# EAGLE design MODUL_PORTEXP_V101 (EAGLE 6.4)
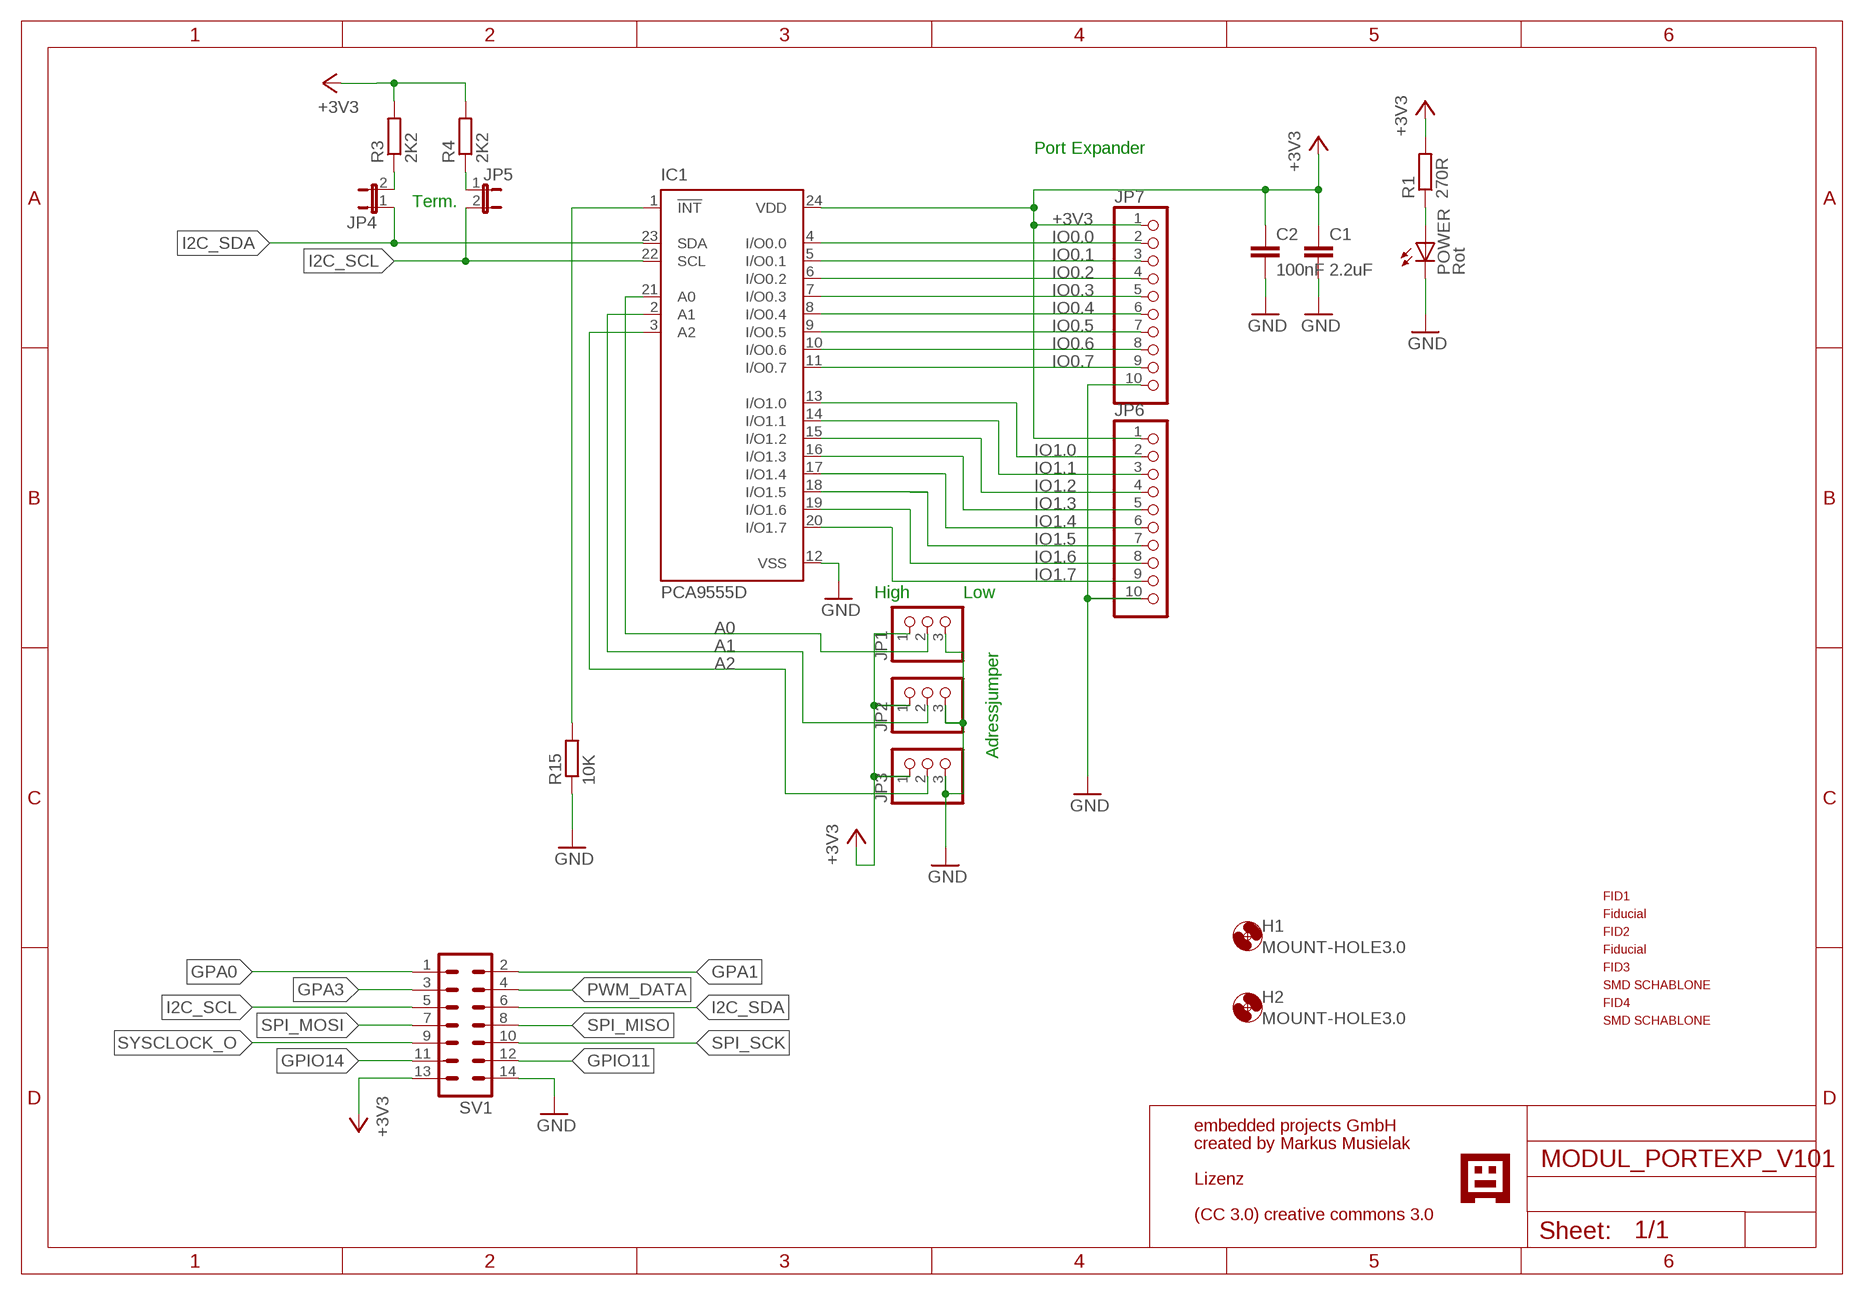
[diagram p0: schematic, sheet 1]

## Parts
C1  2.2uF  C-EUC0805  [C0805]
C2  100nF  C-EUC0805  [C0805]
FID1  PASSERMARKEN_FIDUCIAL  [PASSERMARKEN_FIDUCIAL]
FID2  PASSERMARKEN_FIDUCIAL  [PASSERMARKEN_FIDUCIAL]
FID3  PASSERMARKEN_FIDUCIAL  [PASSERMARKEN_FIDUCIAL]
FID4  PASSERMARKEN_FIDUCIAL  [PASSERMARKEN_FIDUCIAL]
H1  MOUNT-HOLE3.0  [3,0]
H2  MOUNT-HOLE3.0  [3,0]
IC1  PCA9555D  [SO24]
JP1  PINHD-1X3  [1X03]
JP2  PINHD-1X3  [1X03]
JP3  PINHD-1X3  [1X03]
JP4  JP1E  [JP1]
JP5  JP1E  [JP1]
JP6  PINHD-1X10  [1X10]
JP7  PINHD-1X10  [1X10]
POWER  Rot  LEDCHIP-LED0805  [CHIP-LED0805]
R1  270R  R-EU_R0805  [R0805]
R3  2K2  R-EU_R0805  [R0805]
R4  2K2  R-EU_R0805  [R0805]
R15  10K  R-EU_R0805  [R0805]
SV1  ML14  [ML14]
U$2  GNUBLINLOGOSIEB  [GNUSIEBDRUCK]

## Nets
!INT: IC1.1(!INT) R15.2
+3V3: C1.1 C2.1 IC1.24(VDD) JP1.1 JP2.1 JP3.1 JP6.1 JP7.1 R1.2 R3.2 R4.2 SV1.13
A0: IC1.21(A0) JP1.2
A1: IC1.2(A1) JP2.2
A2: IC1.3(A2) JP3.2
GND: C1.2 C2.2 IC1.12(VSS) JP1.3 JP2.3 JP3.3 JP6.10 JP7.10 POWER.C R15.1 SV1.14
GPA0: SV1.1
GPA1: SV1.2
GPA3: SV1.3
GPIO11: SV1.12
GPIO14: SV1.11
I2C_SCL: IC1.22(SCL) JP5.2 SV1.5
I2C_SDA: IC1.23(SDA) JP4.1 SV1.6
IO0.0: IC1.4(I/O0.0) JP7.2
IO0.1: IC1.5(I/O0.1) JP7.3
IO0.2: IC1.6(I/O0.2) JP7.4
IO0.3: IC1.7(I/O0.3) JP7.5
IO0.4: IC1.8(I/O0.4) JP7.6
IO0.5: IC1.9(I/O0.5) JP7.7
IO0.6: IC1.10(I/O0.6) JP7.8
IO0.7: IC1.11(I/O0.7) JP7.9
IO1.0: IC1.13(I/O1.0) JP6.2
IO1.1: IC1.14(I/O1.1) JP6.3
IO1.2: IC1.15(I/O1.2) JP6.4
IO1.3: IC1.16(I/O1.3) JP6.5
IO1.4: IC1.17(I/O1.4) JP6.6
IO1.5: IC1.18(I/O1.5) JP6.7
IO1.6: IC1.19(I/O1.6) JP6.8
IO1.7: IC1.20(I/O1.7) JP6.9
N$1: JP4.2 R3.1
N$2: POWER.A R1.1
N$5: JP5.1 R4.1
PWM_DATA: SV1.4
SPI_MISO: SV1.8
SPI_MOSI: SV1.7
SPI_SCK: SV1.10
SYSCLOCK_O: SV1.9

## Notes on the sheet
- Port Expander
- Term.
- High | Low
- Adressjumper
- embedded projects GmbH
- created by Markus Musielak
- Lizenz
- (CC 3.0) creative commons 3.0

## Library data of the parts
C1 C2 = rcl:C-EU: CAPACITOR, European symbol
FID1 FID2 = KUBUS3:PASSERMARKEN_FIDUCIAL: SMD Passermarke
FID3 FID4 = SMDSCHABLONE:PASSERMARKEN_FIDUCIAL: SMD Passermarke
H1 H2 = holes:MOUNT-HOLE: MOUNTING HOLE with drill center marker
IC1 = micro-philips:PCA9555: 16-bit I2C and SMBus I/O port with interrupt Source: PCA9555_5.pdf; MPN: PCA9555DW; OC_FARNELL: 8906076; OC_NEWARK: 63K6067
JP1-JP3 = pinhead:PINHD-1X3: PIN HEADER
JP4 JP5 = jumper:JP1E: JUMPER
JP6 JP7 = pinhead:PINHD-1X10: PIN HEADER
POWER = led:LED: LED OSRAM: - CHIPLED LG R971, LG N971, LY N971, LG Q971, LY Q971, LO R971, LY R971 LH N974, LH R974 LS Q976, LO Q976, LY Q976 LO Q996 - Hyper CHIPLED LW Q18S LB Q993, LB Q99A, LB R99A - SideLED LS A670, LO A670, LY A670, LG A670, LP A670 LB A673, LV A673, LT A673, LW A673 LH A674 LY A675 LS A676, LA A676, LO A676, LY A676, LW A676 LS A679, LY A679, LG A679 - Hyper Micro SIDELED® LS Y876, LA Y876, LO Y876, LY Y876 LT Y87S - SmartLED LW L88C, LW L88S LB L89C, LB L89S, LG L890 LS L89K, LO L89K, LY L89K LS L896, LA L896, LO L896, LY L896 - TOPLED LS T670, LO T670, LY T670, LG T670, LP T670 LSG T670, LSP T670, LSY T670, LOP T670, LYG T670 LG T671, LOG T671, LSG T671 LB T673, LV T673, LT T673, LW T673 LH T674 LS T676, LA T676, LO T676, LY T676, LB T676, LH T676, LSB T676, LW T676 LB T67C, LV T67C, LT T67C, LS T67K, LO T67K, LY T67K, LW E67C LS E67B, LA E67B, LO E67B, LY E67B, LB E67C, LV E67C, LT E67C LW T67C LS T679, LY T679, LG T679 LS T770, LO T770, LY T770, LG T770, LP T770 LB T773, LV T773, LT T773, LW T773 LH T774 LS E675, LA E675, LY E675, LS T675 LS T776, LA T776, LO T776, LY T776, LB T776 LHGB T686 LT T68C, LB T68C - Hyper Mini TOPLED® LB M676 - Mini TOPLED Santana® LG M470 LS M47K, LO M47K, LY M47K Source: http://www.osram.convergy.de LUXEON: - LUMILED® LXK2-PW12-R00, LXK2-PW12-S00, LXK2-PW14-U00, LXK2-PW14-V00 LXK2-PM12-R00, LXK2-PM12-S00, LXK2-PM14-U00 LXK2-PE12-Q00, LXK2-PE12-R00, LXK2-PE12-S00, LXK2-PE14-T00, LXK2-PE14-U00 LXK2-PB12-K00, LXK2-PB12-L00, LXK2-PB12-M00, LXK2-PB14-N00, LXK2-PB14-P00, LXK2-PB14-Q00 LXK2-PR12-L00, LXK2-PR12-M00, LXK2-PR14-Q00, LXK2-PR14-R00 LXK2-PD12-Q00, LXK2-PD12-R00, LXK2-PD12-S00 LXK2-PH12-R00, LXK2-PH12-S00 LXK2-PL12-P00, LXK2-PL12-Q00, LXK2-PL12-R00 Source: www.luxeon.com KINGBRIGHT: KA-3528ASYC Source: www.kingbright.com
R1 R3 R4 R15 = rcl:R-EU_: RESISTOR, European symbol
SV1 = con-ml:ML14: HARTING; OC_FARNELL: unknown; OC_NEWARK: unknown
U$2 = EmbeddedProjectsLogos2:GNUBLINLOGO

## Board
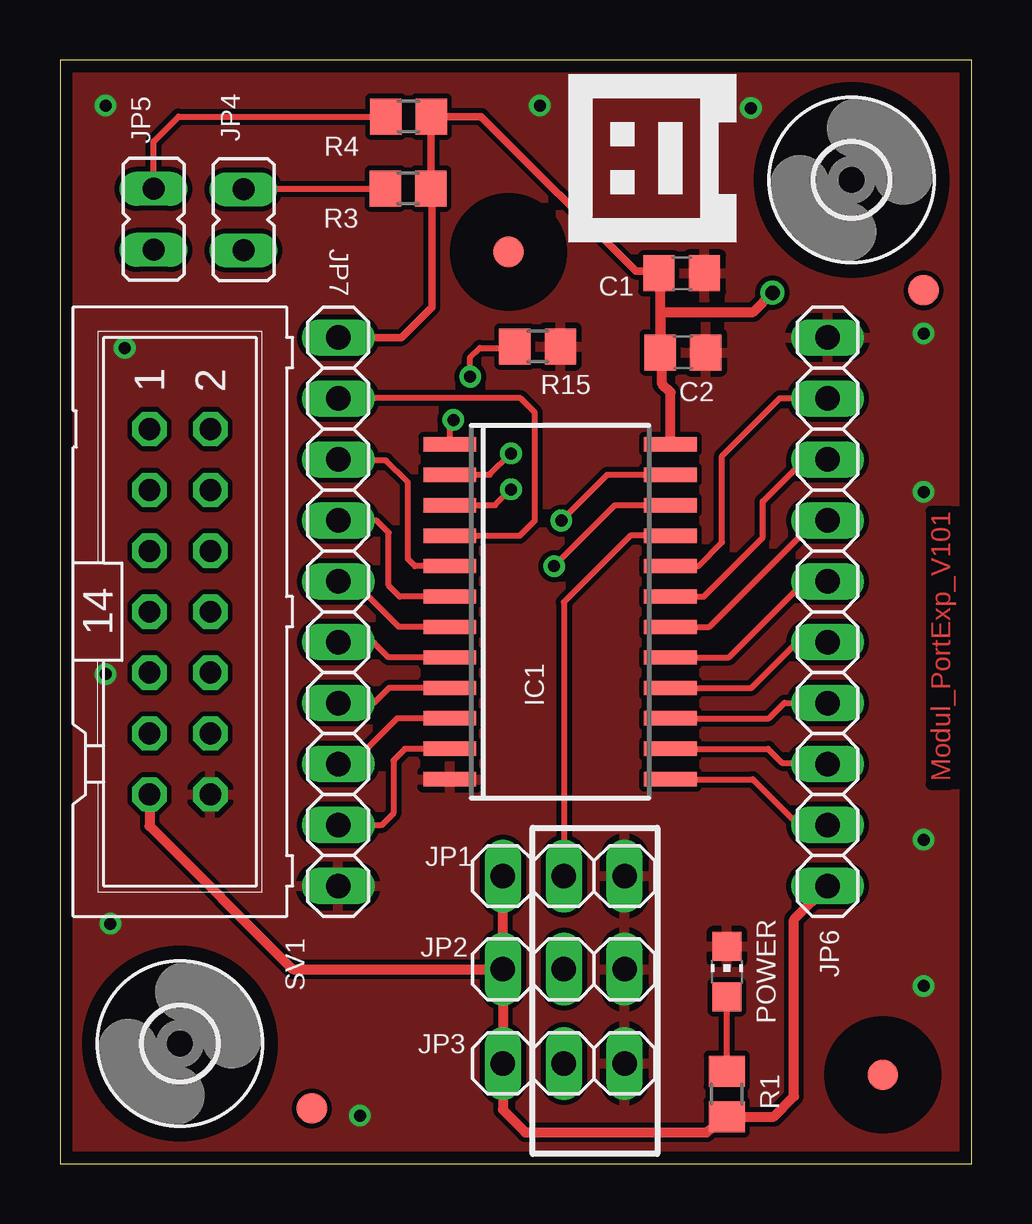
[diagram p1: board, top side]
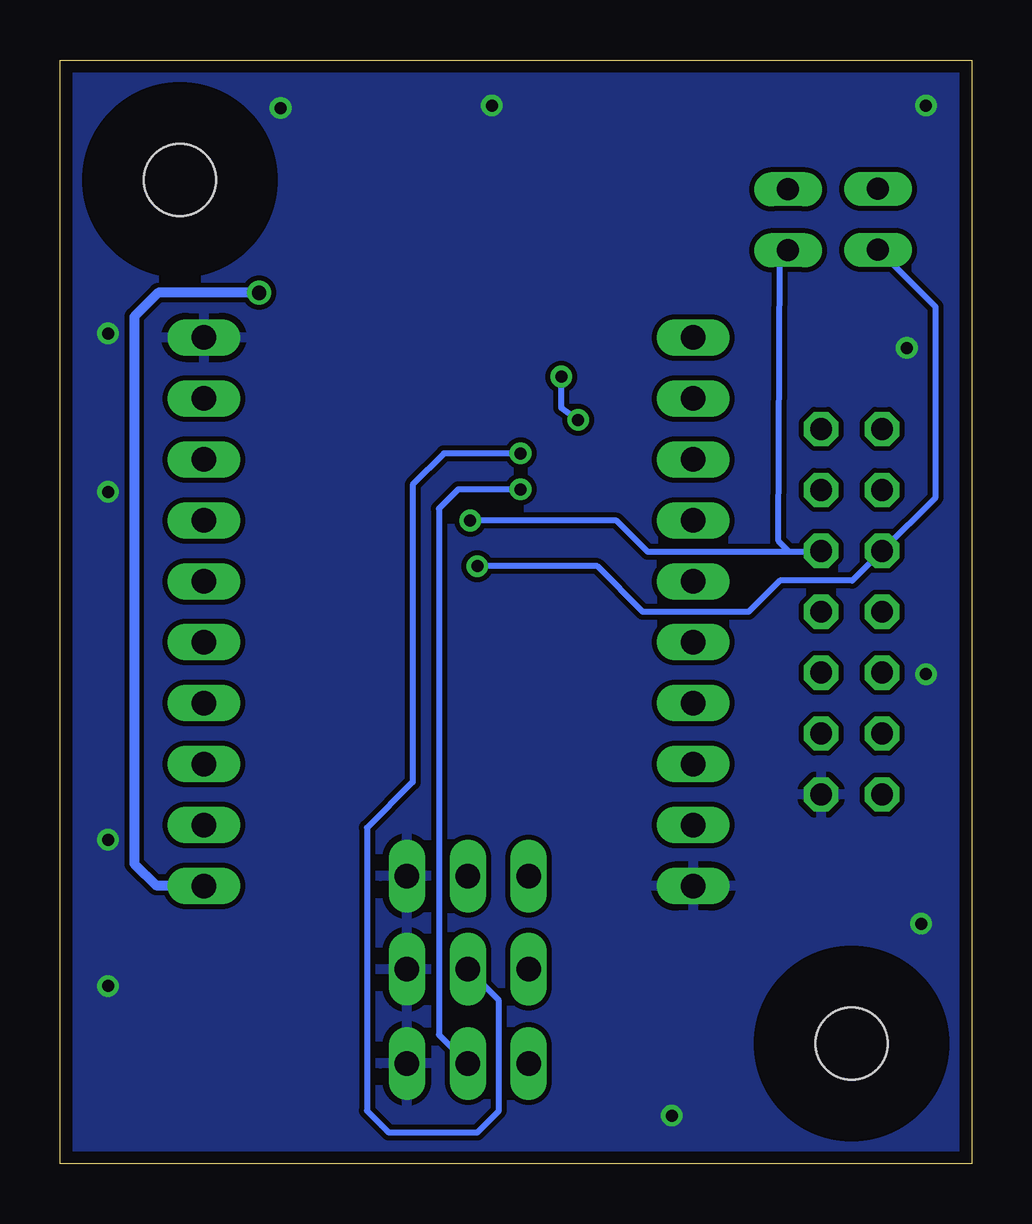
[diagram p2: board, bottom side, seen from below]

Size 38 x 46 mm. Coordinates in mm from the lower left corner, seen from the top.
Outline: 0,0 38,0 38,46 0,46 0,0
Copper layers (1*16): Top 0.035mm / dielectric 1.5mm / Bottom 0.035mm
Design rules "default *": minimum track width 10mil, minimum drill 24mil, track to track 8mil, track to pad 8mil, pad to pad 8mil, via to via 8mil, smd to smd 8mil, copper to edge 20mil, drill to drill 8mil, minimum pad ring 10mil, minimum via ring 8mil, stop-mask expansion 4mil, vias tented up to drill 40mil, thermal gap 10mil

### Footprints (pad centres in the part's own frame; a part is rotated, then mirrored left to right if it is on the bottom)
C0805 = smd 1.3 x 1.5: 1 -0.95,0; 2 0.95,0
PASSERMARKEN_FIDUCIAL = smd 1.27 x 1.27: 1 0,0
3,0 = hole 3: 0,0
SO24 = smd 0.6 x 2.2: 1 -6.985,-4.6; 2 -5.715,-4.6; 3 -4.445,-4.6; 4 -3.175,-4.6; 5 -1.905,-4.6; 6 -0.635,-4.6; 7 0.635,-4.6; 8 1.905,-4.6; 9 3.175,-4.6; 10 4.445,-4.6; 11 5.715,-4.6; 12 6.985,-4.6; 13 6.985,4.6; 14 5.715,4.6; 15 4.445,4.6; 16 3.175,4.6; 17 1.905,4.6; 18 0.635,4.6; 19 -0.635,4.6; 20 -1.905,4.6; 21 -3.175,4.6; 22 -4.445,4.6; 23 -5.715,4.6; 24 -6.985,4.6
1X03 = drill 1.016 long: 1 -2.54,0; 2 0,0; 3 2.54,0
JP1 = drill 0.914 long: 1 0,-1.27; 2 0,1.27
1X10 = drill 1.016 long: 1 -11.43,0; 2 -8.89,0; 3 -6.35,0; 4 -3.81,0; 5 -1.27,0; 6 1.27,0; 7 3.81,0; 8 6.35,0; 9 8.89,0; 10 11.43,0
CHIP-LED0805 = smd 1.2 x 1.2: A 0,-1.05; C 0,1.05
R0805 = smd 1.3 x 1.5: 1 -0.95,0; 2 0.95,0
ML14 = drill 0.914 octagon: 1 -7.62,-1.27; 2 -7.62,1.27; 3 -5.08,-1.27; 4 -5.08,1.27; 5 -2.54,-1.27; 6 -2.54,1.27; 7 0,-1.27; 8 0,1.27; 9 2.54,-1.27; 10 2.54,1.27; 11 5.08,-1.27; 12 5.08,1.27; 13 7.62,-1.27; 14 7.62,1.27

### Placement (x,y rotation side)
C1  25.92,37.11 0 top
C2  25.97,33.81 0 top
FID1  34.3,3.7 0 top
FID2  18.7,38 0 top
FID3  10.5,2.3 0 top
FID4  36,36.4 0 top
H1  5,5 0 top
H2  33,41 0 top
IC1  20.85,23 270 top
JP1  21,11.98 0 top
JP2  21,8.1 0 top
JP3  21,4.17 0 top
JP4  7.65,39.34 0 top
JP5  3.9,39.36 180 top
JP6  32,23 90 top
JP7  11.6,23 270 top
POWER  27.8,8 0 top
R1  27.8,2.9 270 top
R3  14.51,40.64 0 top
R4  14.53,43.64 0 top
R15  19.91,34.06 180 top
SV1  5,23 270 top
U$2  28.2,38.4 90 top

### Tracks (layer width: path | path; a pad name or v marks a point on that pad's centre or on a via)
!INT  (via drill 0.5)
  Top 0.254: IC1.1 16.25,30.85 v16.4,31 | v17.1,32.8 17.1,33.6 17.5,34 18.9,34 R15.2
  Bottom 0.254: v16.4,31 17.1,31.5 v17.1,32.8
+3V3  (via drill 0.6)
  Top 0.305: C2.1 25.05,33.58 25.1,33.53 | R3.2 15.46,43.62 R4.2 17.56,43.64 24,37.2 24.88,37.2 C1.1 | R3.2 15.5,40.7 | JP7.1 14.23,34.43 15.5,35.7 15.5,40.6 R3.2
  Top 0.406: C2.1 25.02,36.66 C1.1 | SV1.13 3.73,14.07 9.7,8.1 JP2.1 | JP2.1 JP1.1 | JP2.1 JP3.1 18.46,2.24 19.4,1.3 26.95,1.3 R1.2 29.75,1.95 30.6,2.8 30.6,10.17 JP6.1 | 25.05,33.58 25.05,35.55 25.1,35.5 28.9,35.5 v29.7,36.3 | IC1.24 25.45,32.15 25.1,32.5 25.1,33.53
  Bottom 0.305: 32.03,11.6 JP6.1
  Bottom 0.406: v29.7,36.3 33.9,36.3 34.9,35.3 34.9,12.5 34,11.6 32.03,11.6
A0
  Top 0.254: IC1.21 23.77,26.18 21,23.4 JP1.2
A1  (via drill 0.5)
  Top 0.254: IC1.2 17.91,28.71 v18.8,29.6
  Bottom 0.254: v18.8,29.6 22,29.6 23.3,28.3 23.3,15.9 25.2,14 25.2,2.2 24.3,1.3 20.6,1.3 19.7,2.2 19.7,6.8 JP2.2
A2  (via drill 0.5)
  Top 0.254: IC1.3 18.14,27.45 v18.8,28.1
  Bottom 0.254: v18.8,28.1 21.4,28.1 22.2,27.3 22.2,5.37 JP3.2
GND  (via drill 0.5)
  other vias: 12.5,2 36,7.4 2.1,10 1.9,20.4 1.9,44.1 2.7,34 20,44.1 28.8,44 36,28 36,34.6 36,13.5
  pour Bottom: -2.7,-3.6 40.5,-3.6 40.5,48.9 -2.7,48.9
  pour Top: -2.7,-3.3 40.2,-3.3 40.2,48.5 -2.7,48.5
I2C_SCL  (via drill 0.5)
  Top 0.254: IC1.22 23.14,27.45 v20.6,24.9
  Bottom 0.254: v20.6,24.9 15.6,24.9 13.7,23 9.3,23 8,24.3 4.97,24.3 SV1.5 1.5,27.77 1.5,35.7 JP5.2
I2C_SDA  (via drill 0.5)
  Top 0.254: IC1.23 22.82,28.71 v20.9,26.8
  Bottom 0.254: 7.6,25.5 6.43,25.5 SV1.6 | 7.6,25.5 13.5,25.5 14.8,26.8 v20.9,26.8 | 7.6,25.5 8.05,25.95 8,37.7 8,37.72 JP4.1
IO0.0
  Top 0.254: IC1.4 19.18,26.18 19.8,26.8 19.8,31.3 19.2,31.9 JP7.2
IO0.1
  Top 0.254: IC1.5 14.79,24.91 14.5,25.2 14.5,28.4 13.6,29.3 11.65,29.3 JP7.3
IO0.2
  Top 0.254: IC1.6 14.16,23.64 13.7,24.1 13.7,26.3 13.2,26.8 JP7.4
IO0.3
  Top 0.254: IC1.7 14.13,22.36 12.2,24.3 11.63,24.3 JP7.5
IO0.4
  Top 0.254: IC1.8 13.71,21.09 13.1,21.7 11.63,21.7 JP7.6
IO0.5
  Top 0.254: IC1.9 13.72,19.82 13.1,19.2 JP7.7
IO0.6
  Top 0.254: IC1.10 14.05,18.55 12.2,16.7 11.65,16.7 JP7.8
IO0.7
  Top 0.254: IC1.11 14.38,17.29 13.9,16.8 13.9,14.6 13.4,14.1 JP7.9
IO1.0
  Top 0.254: IC1.13 28.89,16.02 30.8,14.1 JP6.2
IO1.1
  Top 0.254: IC1.14 29.52,17.29 30.1,16.7 31.95,16.7 JP6.3
IO1.2
  Top 0.254: IC1.15 29.55,18.55 30.2,19.2 JP6.4
IO1.3
  Top 0.254: IC1.16 28.82,19.82 30.7,21.7 31.97,21.7 JP6.5
IO1.4
  Top 0.254: IC1.17 27.89,21.09 31.1,24.3 31.97,24.3 JP6.6
IO1.5
  Top 0.254: IC1.18 27.07,22.36 31.5,26.8 JP6.7
IO1.6
  Top 0.254: IC1.19 26.84,23.64 29.3,26.1 29.3,27.6 31,29.3 31.95,29.3 JP6.8
IO1.7
  Top 0.254: IC1.20 26.61,24.91 27.6,25.9 27.6,29.5 30,31.9 JP6.9
N$1
  Top 0.254: R3.1 7.78,40.64 JP4.2
N$2
  Top 0.254: R1.1 POWER.A
N$5
  Top 0.254: R4.1 4.94,43.64 3.9,42.6 JP5.1

### Text on the board
Top: Modul_PortExp_V101
tDocu: SCL | SDA | I2C-Pullups | +3V3 | GND | 0.0 | 1.7 | 0.1 | 1.6 | 0.2 | 1.5 | 0.3 | 1.4 | 0.4 | 1.3 | 0.5 | 1.2 | 0.6 | 1.1 | 0.7 | 1.0 | www.gnublin.org | GND | +3V3 | A0 | A1 | A2 | High | Low